# Altium schematic sheet Button.SchDoc
size A4; SheetNumber: 10; SheetTotal: 15
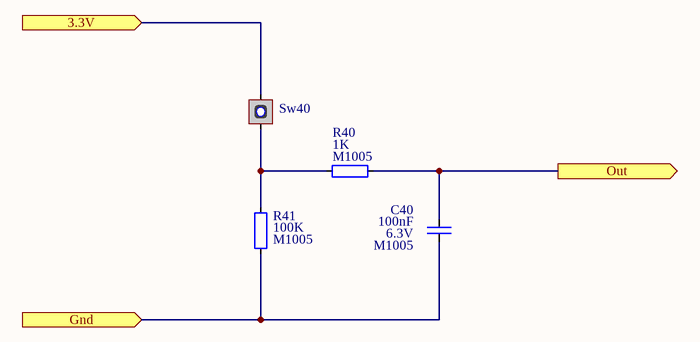
[diagram p0: Button.SchDoc]

## Parts
C40  value 100nF  Voltage: 6.3V  Package: M1005  [Capacitor_Ceramic_M1005_I0402]  (hidden comment: Capacitor_Ceramic)
R40  value 1K  Package: M1005  [Resistor_Smd_M1005_I0402]  (hidden comment: Resistor)
R41  value 100K  Package: M1005  [Resistor_Smd_M1005_I0402]  (hidden comment: Resistor)
Sw40  Tactile, SPST  [Tactile, SPST - Panasonic, EVQQ2]  (value not drawn)

## Ports
3.3V (in), Gnd (in), Out (out)

## Nets
3.3V: Sw40.A ; port 3.3V
Gnd: C40.2 R41.2 ; port Gnd
Out: C40.1 R40.2 ; port Out
NetR40_1: R40.1 R41.1 Sw40.B

## Library data of the parts
C40 = Capacitor_Ceramic: Cap, Cer, 100nF, 6.3V, M1005; Manufacturer Part Number: 04026D104KAT4A; Manufacturer: Kyocera; Temperature Coefficient: X5R; Tolerance: 10%; ComponentLink1Description: Datasheet; ComponentLink1URL: E:\Altium\Datasheets\Capacitor\Kyocera - X5R.pdf; ComponentLink2Description: Supplier Link; ComponentLink2URL: https://www.digikey.com/en/products/detail/kyocera-avx/04026D104KAT4A/8107673; Supplier: Digikey; Supplier Part Number: 478-11504-1-ND; Operating Temperature, Min: +85℃; Operating Temperature, Max: -55℃; Quantity, Min: 1; Quantity, Max: 250000; Price, Min: 0.1; Supplier Currency: $; Price, Max: 0.00189; Supplier Link: https://www.digikey.com/en/products/detail/kyocera-avx/04026D104KAT4A/8107673; Component Type: Ceramic; Component Category: Capacitor
R40 = Resistor: Res, 1K, 1%, M1005; Manufacturer: Yageo; Manufacturer Part Number: RC0402FR-071KP; Component Category: Resistor; Component Type: Fixed Value; Tolerance: 1%; Supplier Link: https://www.digikey.com/en/products/detail/yageo/RC0402FR-071KP/4935269; Supplier Currency: $; Price, Max: 0.00282; Price, Min: 0.1; Quantity, Max: 100000; Quantity, Min: 1; Operating Temperature, Max: -55℃; Operating Temperature, Min: +155℃; Supplier Part Number: YAG1254CT-ND; Supplier: Digikey; ComponentLink1Description: Datasheet; ComponentLink1URL: E:\Altium\Datasheets\Resistor\Yageo - RC_L Series.pdf; ComponentLink2Description: Supplier Link; ComponentLink2URL: https://www.digikey.com/en/products/detail/yageo/RC0402FR-071KP/4935269
R41 = Resistor: Res, 100K, 1%, M1005; Manufacturer: Yageo; Manufacturer Part Number: RC0402FR-07100KP; Component Category: Resistor; Component Type: Fixed Value; Tolerance: 1%; Supplier Link: https://www.digikey.com/en/products/detail/yageo/RC0402FR-07100KP/12698883; Supplier Currency: $; Price, Max: 0.00282; Price, Min: 0.1; Quantity, Max: 100000; Quantity, Min: 1; Operating Temperature, Max: -55℃; Operating Temperature, Min: +155℃; Supplier Part Number: 13-RC0402FR-07100KPCT-ND; Supplier: Digikey; ComponentLink1Description: Datasheet; ComponentLink1URL: E:\Altium\Datasheets\Resistor\Yageo - RC_L Series.pdf; ComponentLink2Description: Supplier Link; ComponentLink2URL: https://www.digikey.com/en/products/detail/yageo/RC0402FR-07100KP/12698883
Sw40 = Tactile, SPST: Switch, Tactile, SPST, SMD; Manufacturer: Panasonic; Manufacturer Part Number: EVQ-Q2K03W; ComponentLink1Description: Datasheet; ComponentLink1URL: E:\Altium\Datasheets\Switch\Tactile, SPST - Panasonic, EVQP0, EVQQ2, EVQ6Q2, EVQ7Q2, EVPBT Series.pdf; ComponentLink2Description: Supplier Link; ComponentLink2URL: https://www.digikey.com/en/products/detail/panasonic-electronic-components/EVQ-Q2K03W/762893; Supplier: Digikey; Supplier Part Number: P12943SCT-ND; Operating Temperature, Min: -40℃; Operating Temperature, Max: +85℃; Quantity, Min: 1; Quantity, Max: 10000; Price, Min: 0.32; Supplier Currency: $; Price, Max: 0.16174; Supplier Link: https://www.digikey.com/en/products/detail/panasonic-electronic-components/EVQ-Q2K03W/762893; Component Type: Tactile; Component Category: Switch; Package: SMD